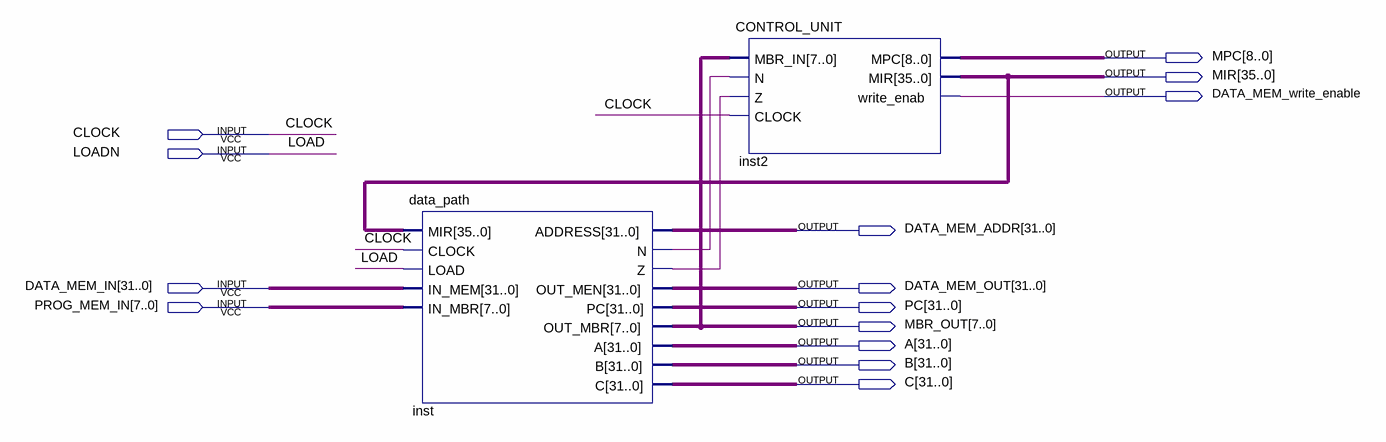
[diagram p0: schematic sheet]
// Quartus schematic CPU.bdf as structural Verilog: 2 symbols, 14 pins
module CPU (
  input  CLOCK,
  input  LOADN,
  input  [31:0] DATA_MEM_IN,
  input  [7:0] PROG_MEM_IN,
  output [8:0] MPC,
  output [35:0] MIR,
  output DATA_MEM_write_enable,
  output [31:0] DATA_MEM_ADDR,
  output [31:0] DATA_MEM_OUT,
  output [31:0] PC,
  output [7:0] MBR_OUT,
  output [31:0] A,
  output [31:0] B,
  output [31:0] C
);

  wire inst_n, inst_z;

  data_path inst (
    .MIR(MIR), .CLOCK(CLOCK), .LOAD(LOADN), .IN_MEM(DATA_MEM_IN), .IN_MBR(PROG_MEM_IN),
    .ADDRESS(DATA_MEM_ADDR), .N(inst_n), .Z(inst_z), .OUT_MEN(DATA_MEM_OUT), .PC(PC), .OUT_MBR(MBR_OUT),
    .A(A), .B(B), .C(C));
  CONTROL_UNIT inst2 (
    .MBR_IN(MBR_OUT), .N(inst_n), .Z(inst_z), .CLOCK(CLOCK), .MPC(MPC), .MIR(MIR),
    .write_enab(DATA_MEM_write_enable));

  // Other names for the same wires on the sheet: LOAD = LOADN
endmodule
